# Altium schematic sheet revisionlog.schdoc: Revision Log
size 431 x 279 mm; DrawnBy: D. Bruey, M. Ciuffo; Organization: Synapse Product Development, LLC.; Address1: 1511 6th Ave., Suite 400; Address2: Seattle, Washington 98101; Address3: 206.381.0898; Address4: www.synapse.com; DocumentNumber: 3; SheetNumber: 3; SheetTotal: 3; PageSetup: Record=PageOptions|CenterHorizontal=True|CenterVertical=True|PrintScale=1.06|XCorrection=1.00|YCorrection=1.00|PrintKind=1|BorderSize=5000000|LeftOffset=0|BottomOffset=0|Orientation=2|PaperLength=4318|PaperWidth=2794|Scale=100|PaperSource=7|PrintQuality=200|MediaType=1|DitherType=10|PrintScaleMode=1|PaperKind=11x17|PaperIndex=3
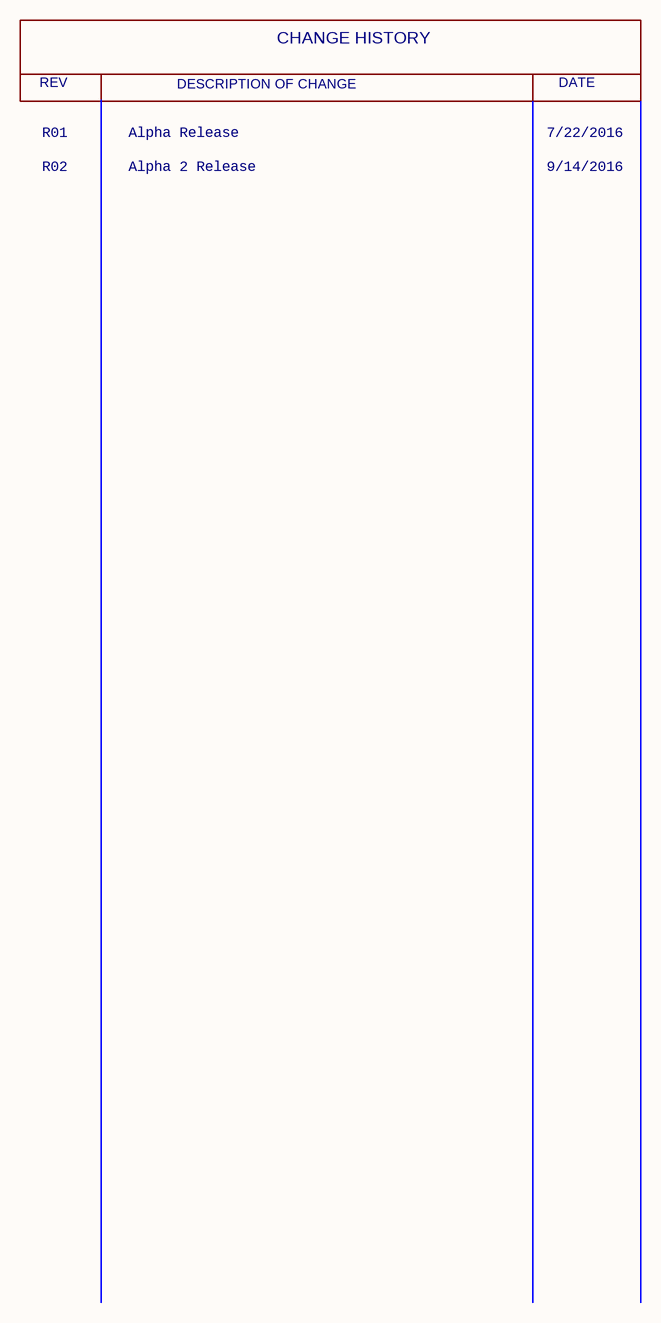
[diagram p0: revisionlog.schdoc]

## Notes on the sheet
- REV
- DESCRIPTION OF CHANGE
- CHANGE HISTORY
- DATE
- R01
- R02
- Alpha Release
- Alpha 2 Release
- 7/22/2016
- 9/14/2016
- Design Notes:
- Layout Notes:
- Project:
- Sheet Title:
- PCBA:
- PROPRIETARY AND CONFIDENTIAL
- Drawn by:
- Schematic Part Number:
- Schematic Revision:
- Date:
- Sheet:
- /